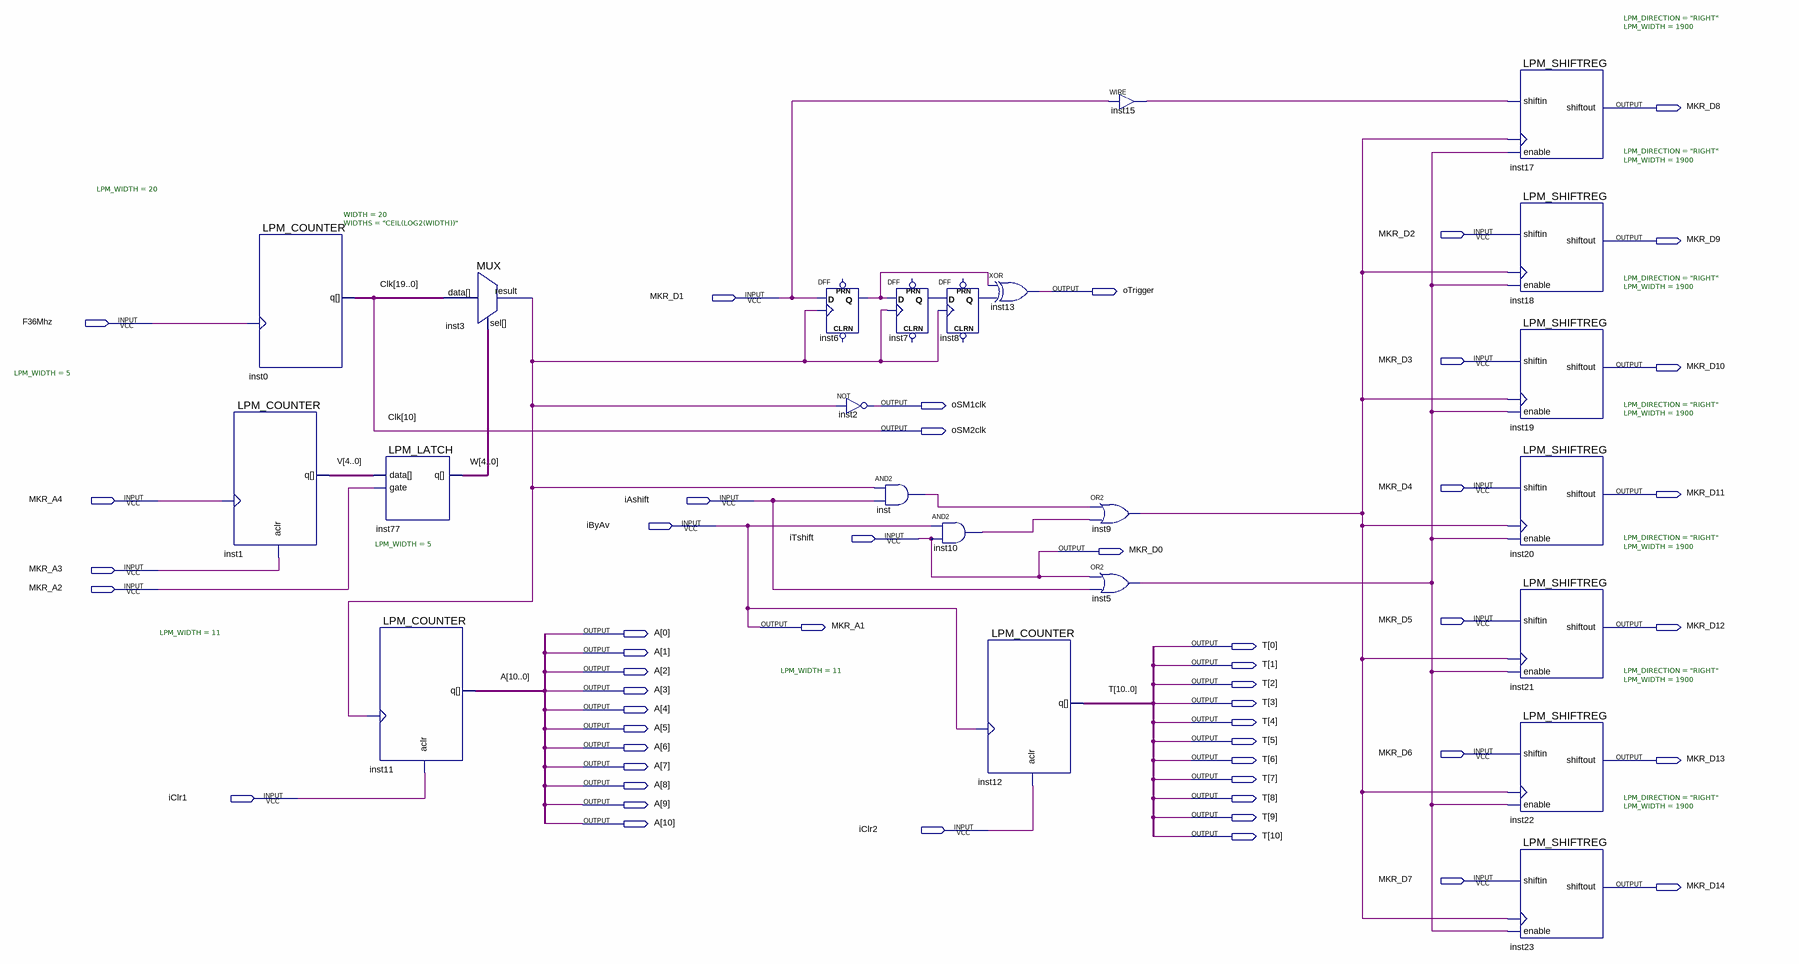
[diagram p0: schematic sheet]
// Quartus schematic Schema.bdf as structural Verilog: 23 symbols, 50 pins
module Schema (
  input  MKR_D2,
  input  MKR_D1,
  input  F36Mhz,
  input  MKR_D3,
  input  MKR_D4,
  input  MKR_A4,
  input  iAshift,
  input  iByAv,
  input  iTshift,
  input  MKR_A3,
  input  MKR_A2,
  input  MKR_D5,
  input  MKR_D6,
  input  iClr1,
  input  iClr2,
  input  MKR_D7,
  output MKR_D8,
  output MKR_D9,
  output oTrigger,
  output MKR_D10,
  output oSM1clk,
  output oSM2clk,
  output MKR_D11,
  output MKR_D0,
  output MKR_A1,
  output MKR_D12,
  output [10:0] A,
  output [10:0] T,
  output MKR_D13,
  output MKR_D14
);

  wire inst3_result, inst5_out, inst6_q, inst7_q, inst8_q, inst9_out, inst10_out, inst15_out, inst_out;
  wire [4:0] V, W;
  wire [19:0] Clk;

  LPM_COUNTER #(.LPM_WIDTH(20)) inst0 (.clock(F36Mhz), .q({Clk[19:11], oSM2clk, Clk[9:0]}));
  LPM_COUNTER #(.LPM_WIDTH(5)) inst1 (.aclr(MKR_A3), .clock(MKR_A4), .q(V));
  LPM_COUNTER #(.LPM_WIDTH(11)) inst11 (.aclr(iClr1), .clock(inst3_result), .q(A));
  LPM_LATCH #(.LPM_WIDTH(5)) inst77 (.data(V), .gate(MKR_A2), .q(W));
  MUX #(.WIDTH(20), .WIDTHS("CEIL(LOG2(WIDTH))")) inst3 (
    .data({Clk[19:11], oSM2clk, Clk[9:0]}), .sel(W), .result(inst3_result));
  DFF inst6 (.CLK(inst3_result), .D(MKR_D1), .Q(inst6_q));  // open: CLRN, PRN
  not inst2 (oSM1clk, inst3_result);
  and inst (inst_out, inst3_result, iAshift);
  DFF inst7 (.CLK(inst3_result), .D(inst6_q), .Q(inst7_q));  // open: CLRN, PRN
  DFF inst8 (.CLK(inst3_result), .D(inst7_q), .Q(inst8_q));  // open: CLRN, PRN
  and inst10 (inst10_out, iByAv, iTshift);
  LPM_COUNTER #(.LPM_WIDTH(11)) inst12 (.aclr(iClr2), .clock(iByAv), .q(T));
  xor inst13 (oTrigger, inst6_q, inst8_q);
  assign inst15_out = MKR_D1;  // WIRE inst15
  or inst9 (inst9_out, inst_out, inst10_out);
  or inst5 (inst5_out, iTshift, iAshift);
  LPM_SHIFTREG #(.LPM_DIRECTION("RIGHT"), .LPM_WIDTH(1900)) inst17 (
    .clock(inst9_out), .enable(inst5_out), .shiftin(inst15_out), .shiftout(MKR_D8));
  LPM_SHIFTREG #(.LPM_DIRECTION("RIGHT"), .LPM_WIDTH(1900)) inst18 (
    .clock(inst9_out), .enable(inst5_out), .shiftin(MKR_D2), .shiftout(MKR_D9));
  LPM_SHIFTREG #(.LPM_DIRECTION("RIGHT"), .LPM_WIDTH(1900)) inst19 (
    .clock(inst9_out), .enable(inst5_out), .shiftin(MKR_D3), .shiftout(MKR_D10));
  LPM_SHIFTREG #(.LPM_DIRECTION("RIGHT"), .LPM_WIDTH(1900)) inst20 (
    .clock(inst9_out), .enable(inst5_out), .shiftin(MKR_D4), .shiftout(MKR_D11));
  LPM_SHIFTREG #(.LPM_DIRECTION("RIGHT"), .LPM_WIDTH(1900)) inst21 (
    .clock(inst9_out), .enable(inst5_out), .shiftin(MKR_D5), .shiftout(MKR_D12));
  LPM_SHIFTREG #(.LPM_DIRECTION("RIGHT"), .LPM_WIDTH(1900)) inst22 (
    .clock(inst9_out), .enable(inst5_out), .shiftin(MKR_D6), .shiftout(MKR_D13));
  LPM_SHIFTREG #(.LPM_DIRECTION("RIGHT"), .LPM_WIDTH(1900)) inst23 (
    .clock(inst9_out), .enable(inst5_out), .shiftin(MKR_D7), .shiftout(MKR_D14));

  assign MKR_A1 = iByAv;
  assign MKR_D0 = iTshift;

  // Other names for the same wires on the sheet: Clk[10] = oSM2clk
endmodule
